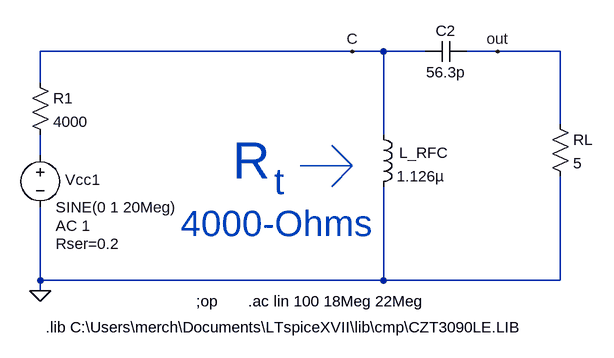
[diagram p0: schematic RF_impedance_Transformer_NoBW.asc]
RF_impedance_Transformer_NoBW.asc, the LTspice schematic file:
Version 4
SHEET 1 2688 680
WIRE 240 -48 -240 -48
WIRE 288 -48 240 -48
WIRE 352 -48 288 -48
WIRE 464 -48 416 -48
WIRE 560 -48 464 -48
WIRE -240 0 -240 -48
WIRE 560 64 560 -48
WIRE 288 80 288 -48
WIRE -240 112 -240 80
WIRE -240 304 -240 192
WIRE 288 304 288 160
WIRE 288 304 -240 304
WIRE 560 304 560 144
WIRE 560 304 288 304
WIRE -240 320 -240 304
FLAG -240 320 0
FLAG 464 -48 out
FLAG 240 -48 C
SYMBOL ind 272 64 R0
WINDOW 0 40 44 Left 2
SYMATTR InstName L_RFC
SYMATTR Value 1.126µ
SYMATTR SpiceLine Ipk=12 Rser=0.0 Cpar=0
SYMBOL cap 416 -64 R90
WINDOW 0 0 32 VBottom 2
WINDOW 3 32 32 VTop 2
SYMATTR InstName C2
SYMATTR Value 56.3p
SYMATTR SpiceLine V=2.5K Irms=0 Rser=0 Lser=0
SYMBOL res 544 48 R0
SYMATTR InstName RL
SYMATTR Value 5
SYMBOL voltage -240 96 R0
WINDOW 123 24 124 Left 2
WINDOW 39 24 152 Left 2
WINDOW 0 38 53 Left 2
SYMATTR Value2 AC 1
SYMATTR SpiceLine Rser=0.2
SYMATTR InstName Vcc1
SYMATTR Value SINE(0 1 20Meg)
SYMBOL res -256 -16 R0
SYMATTR InstName R1
SYMATTR Value 4000
TEXT -232 376 Left 2 !.lib C:\\Users\\merch\\Documents\\LTspiceXVII\\lib\\cmp\\CZT3090LE.LIB
TEXT 0 336 Left 2 !;op
TEXT 80 336 Left 2 !.ac lin 100 18Meg 22Meg
TEXT 56 120 Left 6 ;R
TEXT 120 152 Left 5 ;t
TEXT -24 216 Left 5 ;4000-Ohms
LINE Normal 240 128 160 128
LINE Normal 240 128 208 96
LINE Normal 240 128 240 128 2
LINE Normal 208 160 240 128

The netlist it stands for:
* RF_impedance_Transformer_NoBW.asc
L_RFC C 0 1.126µ Ipk=12 Rser=0.0 Cpar=0
C2 out C 56.3p V=2.5K Irms=0 Rser=0 Lser=0
RL out 0 5
Vcc1 N001 0 SINE(0 1 20Meg) AC 1 Rser=0.2
R1 C N001 4000
.lib C:\Users\merch\Documents\LTspiceXVII\lib\cmp\CZT3090LE.LIB
;op
.ac lin 100 18Meg 22Meg
* R
* t
* 4000-Ohms
.backanno
.end